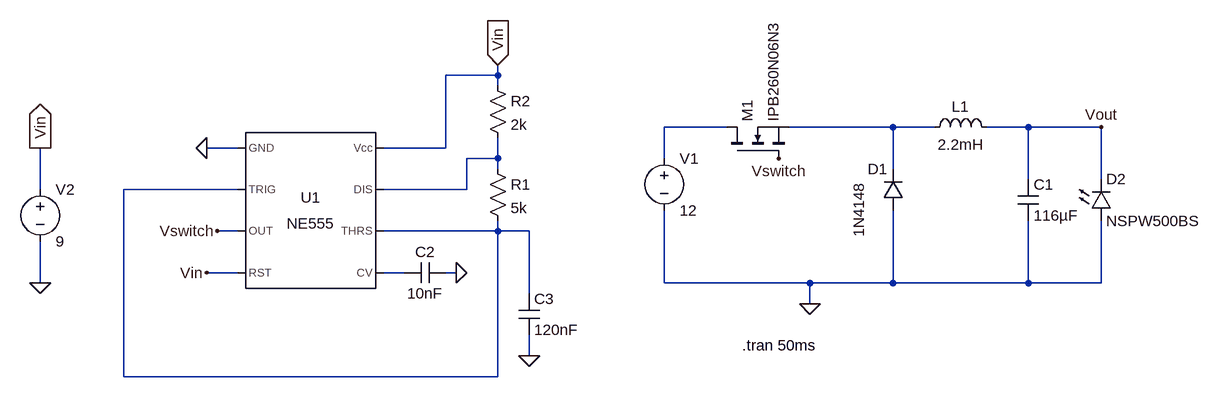
[diagram p0: schematic Buck Converter Final.asc]
Buck Converter Final.asc, the LTspice schematic file:
Version 4
SHEET 1 924 680
WIRE -160 -32 -160 -48
WIRE -160 -32 -240 -32
WIRE -160 -16 -160 -32
WIRE 192 48 96 48
WIRE 448 48 288 48
WIRE 512 48 448 48
WIRE 656 48 592 48
WIRE 768 48 656 48
WIRE -560 80 -608 80
WIRE -240 80 -240 -32
WIRE -240 80 -336 80
WIRE -160 96 -160 64
WIRE -160 96 -208 96
WIRE 96 96 96 48
WIRE -160 112 -160 96
WIRE 448 112 448 48
WIRE 656 128 656 48
WIRE 768 128 768 48
WIRE -864 144 -864 80
WIRE -560 144 -736 144
WIRE -208 144 -208 96
WIRE -208 144 -336 144
WIRE -560 208 -592 208
WIRE -160 208 -160 192
WIRE -160 208 -336 208
WIRE -112 208 -160 208
WIRE -560 272 -608 272
WIRE -304 272 -336 272
WIRE -224 272 -240 272
WIRE -864 288 -864 224
WIRE 96 288 96 176
WIRE 320 288 96 288
WIRE 448 288 448 176
WIRE 448 288 320 288
WIRE 656 288 656 192
WIRE 656 288 448 288
WIRE 768 288 768 192
WIRE 768 288 656 288
WIRE -112 304 -112 208
WIRE 320 320 320 288
WIRE -112 400 -112 368
WIRE -736 432 -736 144
WIRE -160 432 -160 208
WIRE -160 432 -736 432
FLAG 320 320 0
FLAG 272 96 Vswitch
FLAG -864 288 0
FLAG -864 80 Vin
IOPIN -864 80 Out
FLAG -608 80 0
FLAG -592 208 Vswitch
FLAG -608 272 Vin
FLAG -160 -48 Vin
IOPIN -160 -48 In
FLAG -224 272 0
FLAG 768 48 Vout
FLAG -112 400 0
SYMBOL voltage 96 80 R0
WINDOW 123 0 0 Left 0
WINDOW 39 0 0 Left 0
SYMATTR InstName V1
SYMATTR Value 12
SYMBOL cap 640 128 R0
SYMATTR InstName C1
SYMATTR Value 116µF
SYMBOL diode 464 176 R180
WINDOW 0 24 64 Left 2
WINDOW 3 69 44 VLeft 2
SYMATTR InstName D1
SYMATTR Value 1N4148
SYMBOL ind 496 64 R270
WINDOW 0 32 56 VTop 2
WINDOW 3 5 56 VBottom 2
SYMATTR InstName L1
SYMATTR Value 2.2mH
SYMBOL LED 752 192 M180
WINDOW 0 24 64 Left 2
WINDOW 3 24 0 Left 2
SYMATTR InstName D2
SYMATTR Value NSPW500BS
SYMATTR Description Diode
SYMATTR Type diode
SYMBOL nmos 192 96 R270
SYMATTR InstName M1
SYMATTR Value IPB260N06N3
SYMBOL Misc\\NE555 -448 176 R0
SYMATTR InstName U1
SYMBOL voltage -864 128 R0
SYMATTR InstName V2
SYMATTR Value 9
SYMBOL res -176 96 R0
SYMATTR InstName R1
SYMATTR Value 5k
SYMBOL res -176 -32 R0
SYMATTR InstName R2
SYMATTR Value 2k
SYMBOL cap -240 256 R90
WINDOW 0 0 32 VBottom 2
WINDOW 3 32 32 VTop 2
SYMATTR InstName C2
SYMATTR Value 10nF
SYMBOL cap -128 304 R0
SYMATTR InstName C3
SYMATTR Value 120nF
TEXT 216 384 Left 2 !.tran 50ms

The netlist it stands for:
* Buck Converter Final.asc
V1 N001 0 12
C1 Vout 0 116µF
D1 0 N002 1N4148
L1 N002 Vout 2.2mH
D2 0 Vout NSPW500BS
M1 N001 Vswitch N002 N002 IPB260N06N3
XU1 0 N004 Vswitch Vin N005 N004 N003 Vin NE555  ; pins GND TRIG OUT RST CV THRS DIS Vcc
V2 Vin 0 9
R1 N003 N004 5k
R2 Vin N003 2k
C2 0 N005 10nF
C3 N004 0 120nF
.model D D
.lib standard.dio
.model NMOS NMOS
.model PMOS PMOS
.lib standard.mos
.tran 50ms
.lib NE555.sub
.backanno
.end